# Altium project MirrorPCB.PrjPcb
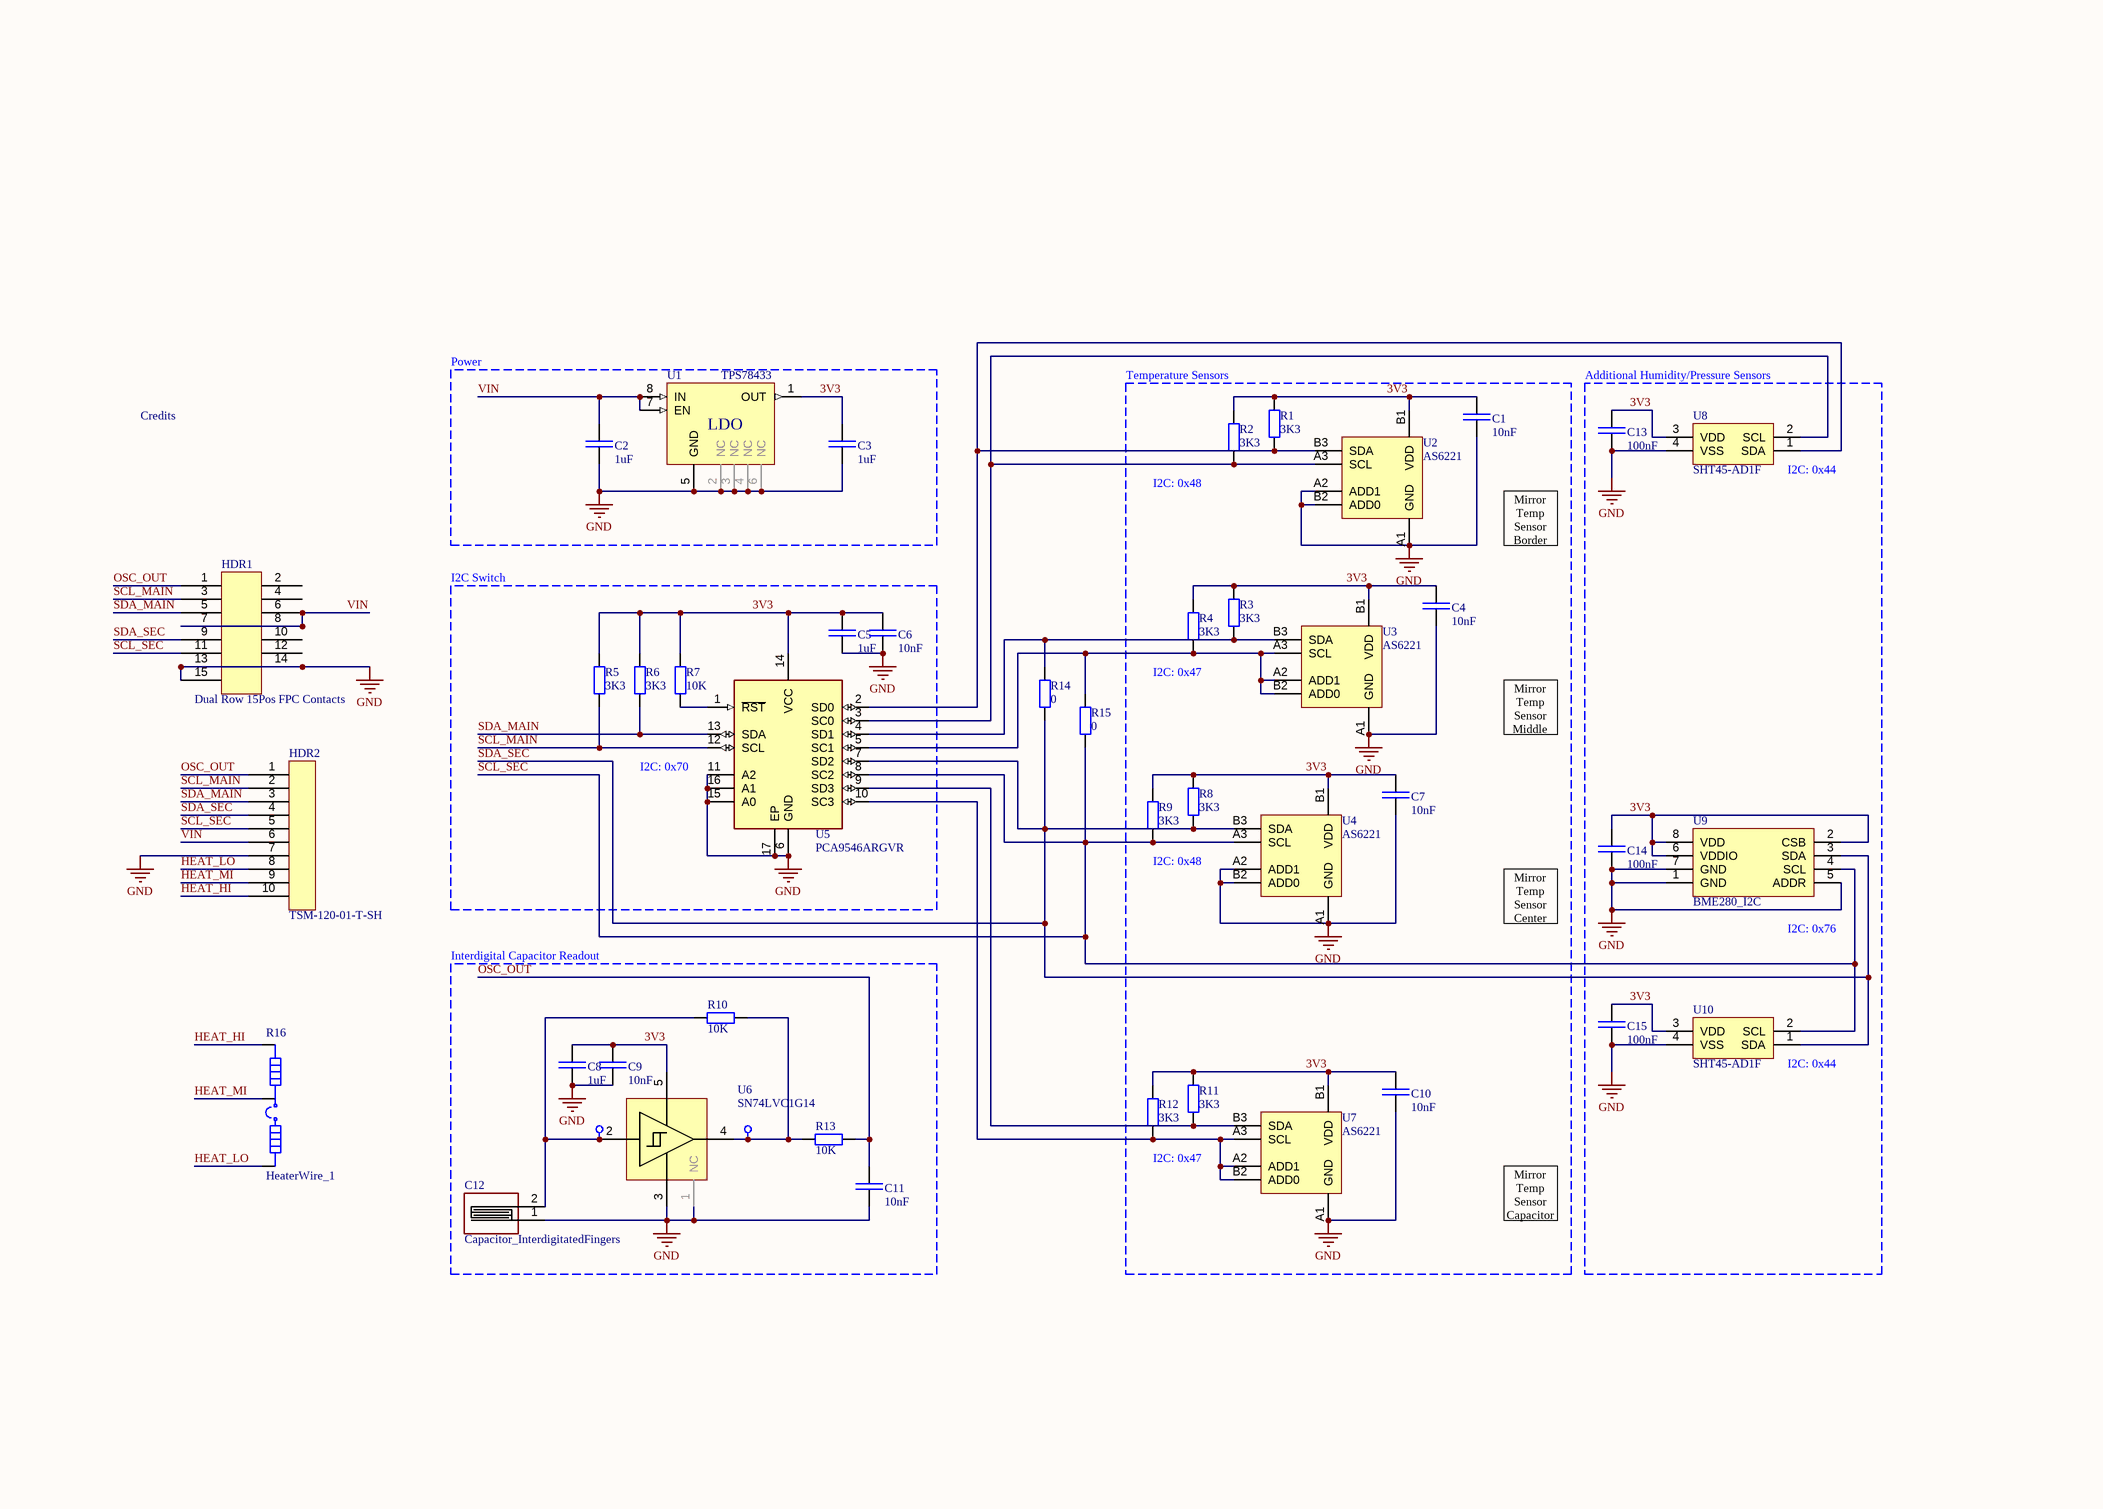
[diagram p0: Mirror_Schematic.SchDoc]
CAGE_CODE: ?????; CONTRACT_NUMBER: <CONTRACT NO>; DOC_NO_ASSY_DWG: <ASSY DWG NO>; DOC_NO_BOM: <BOM DOC NO>; DOC_NO_FAB_DWG: <FAB DWG NO>; DOC_NO_SCH_DWG: <SCH DWG NO>; PCB_2_DEC_TOL: +/-.01; PCB_3_DEC_TOL: +/-.010; PCB_ANG_TOL: +/-1/2; PCB_ASSEMBLY_NO: <PCB ASSY NO>; PCB_CHECKER: - -----; PCB_CHECKER_APP_DATE: --/--/----; PCB_DESIGNER: - -----; PCB_DESIGNER_APP_DATE: --/--/----; PCB_DWG_NO: <PCB DWG NO>; PCB_ENGINEER: - -----; PCB_ENGINEER_APP_DATE: --/--/----; PCB_PART_NUMBER: <PCB PN>; PCB_REV: A; SCH_REV: A
1 sheet, 46 parts. Net scope: global (net labels, ports and power ports of the same name join across sheets).
Board file: Mirror_PCB1.PcbDoc

## Sheet Mirror_Schematic.SchDoc
size A3; SheetNumber: 1; SheetTotal: 1; Project: MirrorPCB; ENG_APP_DATE: --/--/--; DSN_APP_DATE: --/--/--; CHK_APP_DATE: --/--/--

### Parts
C1  10nF  [CAP_SM0402_YAGEOCC2_N]
C2  1uF  [CAP_SM0805_YAGEOCC2_N]
C3  1uF  [CAP_SM0805_YAGEOCC2_N]
C4  10nF  [CAP_SM0402_YAGEOCC2_N]
C5  1uF  [CAP_SM0805_YAGEOCC2_N]
C6  10nF  [CAP_SM0402_YAGEOCC2_N]
C7  10nF  [CAP_SM0402_YAGEOCC2_N]
C8  1uF  [CAP_SM0805_YAGEOCC2_N]
C9  10nF  [CAP_SM0603_YAGEOCC2_N]
C10  10nF  [CAP_SM0402_YAGEOCC2_N]
C11  10nF  [CAP_SM0603_YAGEOCC2_N]
C12  Capacitor_InterdigitatedFingers  [CapacitorWire]
C13  100nF  [CAP_SM0603_YAGEOCC2_N]
C14  100nF  [CAP_SM0603_YAGEOCC2_N]
C15  100nF  [CAP_SM0603_YAGEOCC2_N]
Credit  Credits  [CREDITS_CU_SIGNED]  (value not drawn)
HDR1  Dual Row 15Pos FPC Contacts  [AYF331535_FPC]
HDR2  TSM-120-01-T-SH  [TSM-120-01-T-SH]
J4  S1751-46 TestPoint  [S1751-46 TestPoint]  (value not drawn)
J5  S1751-46 TestPoint  [S1751-46 TestPoint]  (value not drawn)
R1  3K3  [RES_SM0603_YAGEORC_N]
R2  3K3  [RES_SM0603_YAGEORC_N]
R3  3K3  [RES_SM0603_YAGEORC_N]
R4  3K3  [RES_SM0603_YAGEORC_N]
R5  3K3  [RES_SM0603_YAGEORC_N]
R6  3K3  [RES_SM0603_YAGEORC_N]
R7  10K  [RES_SM0603_YAGEORC_N]
R8  3K3  [RES_SM0603_YAGEORC_N]
R9  3K3  [RES_SM0603_YAGEORC_N]
R10  10K  [RES_SM0603_YAGEORC_N]
R11  3K3  [RES_SM0603_YAGEORC_N]
R12  3K3  [RES_SM0603_YAGEORC_N]
R13  10K  [RES_SM0603_YAGEORC_N]
R14  0  [RES_SM0603_YAGEORC_N]
R15  0  [RES_SM0603_YAGEORC_N]
R16  HeaterWire_1  [HeaterWire_1]
U1  TPS78433  [TPS784xxxQDRBRQ1_SON]
U2  AS6221  [AS6221_BGA_LargePads]
U3  AS6221  [AS6221_BGA_LargePads]
U4  AS6221  [AS6221_BGA_LargePads]
U5  PCA9546ARGVR  [QFN65P400X400X100-17N-D]
U6  SN74LVC1G14  [SOT65P210X110-5N_SC70]
U7  AS6221  [AS6221_BGA_LargePads]
U8  SHT45-AD1F  [SHT45 DFN]
U9  BME280_I2C  [BME280]
U10  SHT45-AD1F  [SHT45 DFN]

### Blocks framed on the sheet
Power: C2 C3 U1
Interdigital Capacitor Readout: C8 C9 C11 C12 J4 J5 R10 R13 U6

### Nets
GND: C1.2 C2.2 C3.2 C4.2 C5.2 C6.2 C7.2 C8.2 C9.2 C10.2 C11.2 C12.1 C13.2 C14.2 C15.2 HDR1.13 HDR1.14 HDR1.15 HDR2.7 U1.2(NC) U1.3(NC) U1.4(NC) U1.5(GND) U1.6(NC) U2.A1(GND) U2.A2(ADD1) U2.B2(ADD0) U3.A1(GND) U4.A1(GND) U4.A2(ADD1) U4.B2(ADD0) U5.6(GND) U5.11(A2) U5.15(A0) U5.16(A1) U5.17(EP) U6.1(NC) U6.3 U7.A1(GND) U8.4(VSS) U9.1(GND) U9.5(ADDR) U9.7(GND) U10.4(VSS)
3V3: C1.1 C3.1 C4.1 C5.1 C6.1 C7.1 C8.1 C9.1 C10.1 C13.1 C14.1 C15.1 R1.2 R2.2 R3.2 R4.2 R5.1 R6.1 R7.1 R8.2 R9.2 R11.2 R12.2 U1.1(OUT) U2.B1(VDD) U3.B1(VDD) U4.B1(VDD) U5.14(VCC) U6.5(VCC) U7.B1(VDD) U8.3(VDD) U9.2(CSB) U9.6(VDDIO) U9.8(VDD) U10.3(VDD)
HEAT_HI: HDR2.10 R16.1
HEAT_LO: HDR2.8 R16.3
HEAT_MI: HDR2.9 R16.2
OSC_OUT: C11.1 HDR1.1 HDR2.1 R13.1
SCL_MAIN: HDR1.3 HDR2.2 R5.2 U5.12(SCL)
SCL_SEC: HDR1.11 HDR2.5 R9.1 R15.1 U4.A3(SCL) U5.8(SC2) U9.4(SCL) U10.2(SCL)
SDA_MAIN: HDR1.5 HDR2.3 R6.2 U5.13(SDA)
SDA_SEC: HDR1.9 HDR2.4 R8.1 R14.1 U4.B3(SDA) U5.7(SD2) U9.3(SDA) U10.1(SDA)
VIN: C2.1 HDR1.6 HDR1.7 HDR1.8 HDR2.6 U1.7(EN) U1.8(IN)
NetC12_2: C12.2 J4.1 R10.2 U6.2(A)
NetJ5_1: J5.1 R10.1 R13.2 U6.4(Y)
NetR1_1: R1.1 U2.B3(SDA) U5.2(SD0) U8.1(SDA)
NetR2_1: R2.1 U2.A3(SCL) U5.3(SC0) U8.2(SCL)
NetR3_1: R3.1 R14.2 U3.B3(SDA) U5.4(SD1)
NetR4_1: R4.1 R15.2 U3.A2(ADD1) U3.A3(SCL) U3.B2(ADD0) U5.5(SC1)
NetR7_2: R7.2 U5.1(~{RST})
NetR11_1: R11.1 U5.9(SD3) U7.B3(SDA)
NetR12_1: R12.1 U5.10(SC3) U7.A2(ADD1) U7.A3(SCL) U7.B2(ADD0)

Not connected (* = marked no-connect by the designer): HDR1 2 4 10 12

### Notes on the sheet
- Temperature Sensors
- Additional Humidity/Pressure Sensors
- (near R2) I2C: 0x48
- (near U8) I2C: 0x44
- I2C Switch
- Mirror Temp Sensor Border
- (near R4) I2C: 0x47
- (near U5) I2C: 0x70
- Mirror Temp Sensor Middle
- I2C: 0x48
- Mirror Temp Sensor Center
- (near U9) I2C: 0x76
- (near U10) I2C: 0x44
- I2C: 0x47
- Mirror Temp Sensor Capacitor
- DWG. NO.
- REV.
- SHT.
- THIS DOCUMENT AND THE DATA DISCLOSED HEREIN OR HEREWITH IS THE PROPERTY OF ALTIUM LIMITED AND MAY BE FREELY DISTRIBUTED IN WHOLE. NO RIGHTS ARE RESERVED OR EXPRESS OR IMPLIED WARANTEE GIVEN.
- REVISION
- DESCRIPTION
- DATE
- APPROVED
- ENG:
- APPROVALS
- PROJECT
- DSN:
- CHK:
- REFERENCE DOCUMENTS
- PROJECT REVISION:
- TITLE
- DOCUMENT REVISION:
- DESIGN ITEM:
- BOM:
- FAB DWG:
- PCB DWG:
- ASSY DWG:
- SCALE:
- SIZE
- B
- CAGE CODE
- FILE NAME
- DWG NO.
- SHEET
- OF
- REV
- (in symbol TPS78433QWDRBRQ1) LDO

### Library data of the parts
C1 C4 C6 C7 C10 = CC0402KRX7R9BB103: CAP 10nF SM0402 X7R 50V YAGEO CC2; Manufacturer Part Number: CC0603KRX7R9BB103; Tolerance (%): 10; Voltage Rating (Volts): 50; Category: Capacitor; Manufacturer: Yageo; Package: 0603; Value: 10nF; Supplier Part Number 1: 3369167; Supplier 1: Farnell; ComponentLink1URL: http://www.yageo.com; ComponentLink1Description: Manufacturer Website; Supplier 2: Mouser; Supplier Part Number 2: 603-CC402KRX7R9BB103; Supplier 3: DigiKey; Supplier Part Number 3: 311-1349-1-ND
C2 C3 C5 C8 = CC0805KKX7R8BB105: CAP 1uF SM0805 X7R 25V YAGEO CC2; Tolerance (%): 10; Voltage Rating (Volts): 25; Category: Capacitor; Manufacturer: Yageo; Manufacturer Part Number: CC0805KKX7R8BB105; Package: 0805; Value: 1uF; ComponentLink1URL: http://www.yageo.com; ComponentLink1Description: Manufacturer Website; Supplier 1: Farnell; Supplier Part Number 1: 1458903; Supplier 2: Digikey; Supplier Part Number 2: 311-1456-1-ND; Supplier 3: Mouser; Supplier Part Number 3: 603-CC805KKX7R8BB105; Supplier 4: Future Electronics; Supplier Part Number 4: 7716954; Supplier 5: Arrow Electronics; Supplier Part Number 5: CC0805KKX7R8BB105; Supplier 6: Rs; Supplier Part Number 6: 1988104; Supplier 7: Digikey; Supplier Part Number 7: 311-1456-6-ND
C9 C11 = CC0603KRX7R9BB103: CAP 10nF SM0603 X7R 50V YAGEO CC2; Tolerance (%): 10; Voltage Rating (Volts): 50; Category: Capacitor; Manufacturer: Yageo; Manufacturer Part Number: CC0603KRX7R9BB103; Package: 0603; Value: 10nF; Supplier Part Number 1: 722236; Supplier 1: Farnell; ComponentLink1URL: http://www.yageo.com; ComponentLink1Description: Manufacturer Website; Supplier 2: DigiKey; Supplier Part Number 2: 311-1085-1-ND; Supplier 3: Future Electronics; Supplier Part Number 3: 4131256; Supplier 4: Arrow Electronics; Supplier Part Number 4: CC0603KRX7R9BB103; Supplier 5: Rs; Supplier Part Number 5: 6169537; Supplier 6: Digikey; Supplier Part Number 6: 311-1085-1-ND; Supplier 7: Digikey; Supplier Part Number 7: 311-1085-6-ND; Supplier 8: Mouser; Supplier Part Number 8: 603-CC603KRX7R9BB103
C13-C15 = CC0603KRX7R9BB104: CAP 100nF SM0603 X7R 50V YAGEO CC2; Tolerance (%): 10; Voltage Rating (Volts): 50; Category: Capacitor; Manufacturer: Yageo; Manufacturer Part Number: CC0603KRX7R9BB104; Package: 0603; Value: 100nF; ComponentLink1URL: http://www.yageo.com; ComponentLink1Description: Manufacturer Website; Supplier 1: Mouser; Supplier Part Number 1: 603-CC603KRX7R9BB104; Supplier 2: Future Electronics; Supplier Part Number 2: 3035896; Supplier 3: Future Electronics; Supplier Part Number 3: 9017302; Supplier 4: Arrow Electronics; Supplier Part Number 4: CC0603KRX7R9BB104; Supplier 5: Rs; Supplier Part Number 5: 6698767; Supplier 6: Avnet; Supplier Part Number 6: 68R4788; Supplier 7: Digikey; Supplier Part Number 7: 311-1344-1-ND; Supplier 8: Digikey; Supplier Part Number 8: 311-1344-6-ND
HDR1 = FPC_Contacts_15_DualRow
HDR2 = TSM-120-01-T-SH: SURFACE MOUNT (2.54 mm) .100" PITCH .025" SQ POST HEADER; Supplier 1: Mouser; Supplier Part Number 1: 200-TSM12001TSH; Supplier 2: Digikey; Supplier Part Number 2: TSM-120-01-T-SH-ND
J4 J5 = S1751-46 TestPoint: S1751-46 SMT TestPoint 3.25x1.65; Supplier 1: Rs; Supplier Part Number 1: 1613604; Supplier 2: Rs; Supplier Part Number 2: 1613705; Supplier 3: Digikey; Supplier Part Number 3: 952-3024-ND; Supplier 4: Mouser; Supplier Part Number 4: 855-S1751-46
R1-R6 R8 R9 R11 R12 = RC0603FR-073K3L: RES 3K3 SM0603 YAGEO RC_L; Manufacturer Part Number: RC0603FR-0710KL; Power (Watts): 0.1; Resistance (Ohms): 10000; Tolerance (%): 1; Category: Resistor; Manufacturer: Yageo; Package: 0603; Value: 3K3; Supplier Part Number 1: 1995564; Supplier 1: Rs; ComponentLink1URL: http://www.yageo.com; ComponentLink1Description: Manufacturer Website; Supplier 2: Farnell; Supplier Part Number 2: 9238549; Supplier 3: Digikey; Supplier Part Number 3: 311-3.30KHRCT-ND; Supplier 4: Digikey; Supplier Part Number 4: 311-3.30KHRDKR-ND; Supplier 5: Mouser; Supplier Part Number 5: 603-RC0603FR-073K3L; Supplier 6: Newark; Supplier Part Number 6: 98K7393
R7 R10 R13 = RC0603FR-0710KL: RES 10K SM0603 YAGEO RC_L; Power (Watts): 0.1; Resistance (Ohms): 10000; Tolerance (%): 1; Category: Resistor; Manufacturer: Yageo; Manufacturer Part Number: RC0603FR-0710KL; Package: 0603; Value: 10K; Supplier Part Number 1: 9238603; Supplier 1: Farnell; ComponentLink1URL: http://www.yageo.com; ComponentLink1Description: Manufacturer Website; Supplier 2: Future Electronics; Supplier Part Number 2: 3349388; Supplier 3: Rs; Supplier Part Number 3: 1995443; Supplier 4: Digikey; Supplier Part Number 4: 311-10.0KHRCT-ND; Supplier 5: Digikey; Supplier Part Number 5: 311-10.0KHRDKR-ND; Supplier 6: Mouser; Supplier Part Number 6: 603-RC0603FR-0710KL; Supplier 7: Newark; Supplier Part Number 7: 98K7338
R14 R15 = RC0603FR-070RL: RES 0R SM0603 YAGEO RC_L; Manufacturer Part Number: RC0603FR-0710KL; Power (Watts): 0.1; Resistance (Ohms): 10000; Tolerance (%): 1; Category: Resistor; Manufacturer: Yageo; Package: 0603; Value: 0; ComponentLink1URL: http://www.yageo.com; ComponentLink1Description: Manufacturer Website; Supplier 1: Digikey; Supplier Part Number 1: 311-0.0HRCT-ND; Supplier 2: Digikey; Supplier Part Number 2: 311-0.0HRDKR-ND; Supplier 3: Farnell; Supplier Part Number 3: 2309106; Supplier 4: Mouser; Supplier Part Number 4: 603-RC0603FR-070RL; Supplier 5: Newark; Supplier Part Number 5: 50Y7761
U1 = TPS78433QWDRBRQ1: TPS78433-Q1 3.3V, 300-mA, High-PSRR Low-Dropout Voltage Regulator With High Accuracy and Enable,  8-SON (3x3); Supplier 1: Mouser; Supplier Part Number 1: 595-TPS78433QWDRBRQ1; Supplier 2: Digikey; Supplier Part Number 2: 296-TPS78433QWDRBRQ1CT-ND; Supplier 3: Texas Instruments; Supplier Part Number 3: TPS78433QWDRBRQ1; Supplier 4: Digikey; Supplier Part Number 4: 296-TPS78433QWDRBRQ1DKR-ND; Supplier 5: Digikey; Supplier Part Number 5: 296-TPS78433QWDRBRQ1TR-ND; Supplier 6: LCSC; Supplier Part Number 6: C3747465
U2-U4 U7 = AS6221-AWLT-S: AS6221 Temperature Sensor Digital -40°C ~ 125°C 16b 6-WLCSP (1.5x1.03); Supplier 1: Mouser; Supplier Part Number 1: 985-AS6221-AWLT-S; Supplier 2: Digikey; Supplier Part Number 2: 4991-AS6221-AWLT-SCT-ND; Supplier 3: Arrow Electronics; Supplier Part Number 3: AS6221-AWLT-S; Supplier 4: Future Electronics; Supplier Part Number 4: 1136541; Supplier 5: Digikey; Supplier Part Number 5: 4991-AS6221-AWLT-SDKR-ND; Supplier 6: Digikey; Supplier Part Number 6: 4991-AS6221-AWLT-STR-ND; Supplier 7: Avnet; Supplier Part Number 7: Q65114A1149
U5 = PCA9546ARGVR: 4-Channel I2C And SMBus Switch With Reset Functions; Manufacturer_Name: Texas Instruments; Geometry.Height: 1mm; Mouser Part Number: 595-PCA9546ARGVR; Mouser Price/Stock: https://www.mouser.co.uk/ProductDetail/Texas-Instruments/PCA9546ARGVR?qs=iSMark9AYDVOIxSBd0ujBA%3D%3D; Manufacturer_Part_Number: PCA9546ARGVR; Datasheet Link: http://www.ti.com/lit/gpn/pca9546a; Supplier 1: Mouser; Supplier Part Number 1: 595-PCA9546ARGVR; Supplier 2: Digi-Key; Supplier Part Number 2: 296-21771-1-ND; Supplier 3: Digi-Key; Supplier Part Number 3: 296-21771-6-ND
U6 = SN74LVC1G14: SN74LVC1G14 Single Schmitt-Trigger Inverter 1.65-V to 5.5-V VCC +-24mA Output Current (DBV, DCK, DRL, DRY, DPW, and YZP Package); Supplier 1: Mouser; Supplier Part Number 1: 595-SN74LVC1G14DCKR; Supplier 2: Digikey; Supplier Part Number 2: 296-11608-1-ND; Supplier 3: Digikey; Supplier Part Number 3: 296-11608-6-ND; Supplier 4: LCSC; Supplier Part Number 4: C35740
U8 U10 = SHT45-AD1F: SHT45 4th Gen. High-Accuracy, Ultra-Low-Power, 16-bit, Relative Humidity and Temperature Sensor; Supplier 1: Digikey; Supplier Part Number 1: 1649-SHT45-AD1F-R2CT-ND; Supplier 2: Digikey; Supplier Part Number 2: 1649-SHT45-AD1F-R2DKR-ND; Supplier 3: Farnell; Supplier Part Number 3: 4134537; Supplier 4: Mouser; Supplier Part Number 4: 403-SHT45-AD1F-R2
U9 = BME280_I2C: BME280 Digital humidity, pressure and temperature sensor; Supplier 1: Future Electronics; Supplier Part Number 1: 2053946; Supplier 2: LCSC; Supplier Part Number 2: C92489